# Altium project OpAmpGndOut.PRJPCB
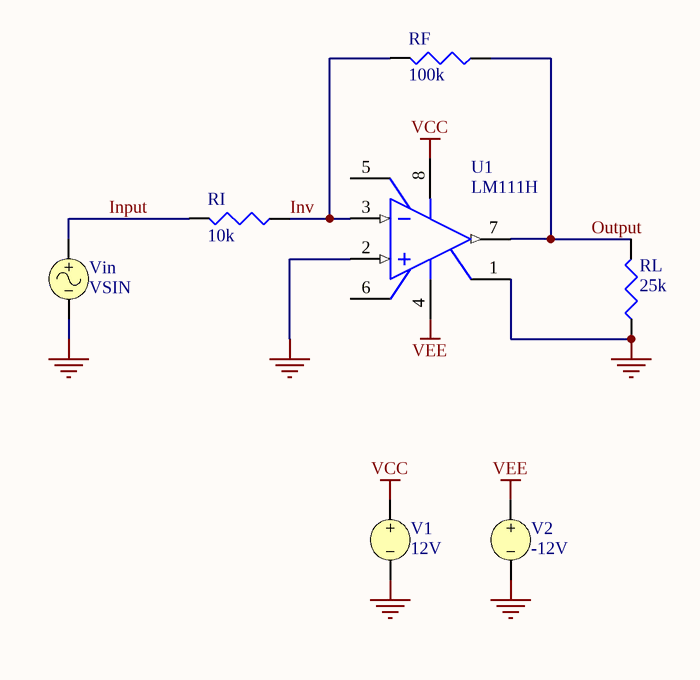
[diagram p0: OpAmpGndOut.schdoc]
1 sheet, 7 parts. Net scope: global (net labels, ports and power ports of the same name join across sheets).

## Sheet OpAmpGndOut.schdoc: Analog Amplifier
size A4; Organization: Altium Limited; Address1: L3, 12a Rodborough Rd; Address2: Frenchs Forest; Address3: NSW; Address4: Australia 2086; DocumentNumber: 1; SheetNumber: 1; SheetTotal: 1

### Parts
RF  100k
RI  10k
RL  25k
U1  LM111H  [H08C]
V1  12V
V2  -12V
Vin  VSIN

### Nets
GND: RL.2(BOT) U1.1(GND) U1.2(IN+) V1.2 V2.2 Vin.2
VCC: U1.8(V+) V1.1
VEE: U1.4(V-) V2.1
Input: RI.1(TOP) Vin.1
Inv: RF.1(TOP) RI.2(BOT) U1.3(IN-)
Output: RF.2(BOT) RL.1(TOP) U1.7(OUT)

Not connected (* = marked no-connect by the designer): U1 5(BAL) 6(BAL/STB)

### Notes on the sheet
- Title
- Size:
- Date:
- A4
- Number:
- Time:
- Revision:
- Sheet
- of
- File:

### Library data of the parts
RF RI RL = RES: Resistor
  RF: Value: 100k
  RI: Value: 10k
  RL: Value: 25k
U1 = LM111H: Voltage Comparator; Manufacturer: National Semiconductor; CompType: Amplifiers; PackageTopMarking: NSZXYTTE# LM111H; DeviceFunction: Amplifier; Published: 4-Dec-2008; DatasheetVersion: Jan-2001; PackageVersion: revF, Jun-1995; PackageReference: H08C; Publisher: Altium Limited; PackageDescription: Metal Can, TO-99, 8 Lead, .200 Dia., P.C.; PartNumber: LM111H; RoHS: O; PinCount: 8; DigiKeyPartNumber: LM111H-ND; Code_JEDEC: TO-99; ComponentLink1Description: LM111 Datasheet; ComponentLink1URL: http://www.national.com/ds/LM/LM111.pdf; ComponentLink2Description: LM111 Web Page; ComponentLink2URL: http://www.national.com/pf/LM/LM111.html; ComponentLink3Description: H08C Package Page; ComponentLink3URL: http://www.national.com/packaging/folders/h08c.html
V1 V2 = VSRC: Voltage Source
  V1: Value: 12V
  V2: Value: -12V
Vin = VSIN: Sinusoidal Voltage Source